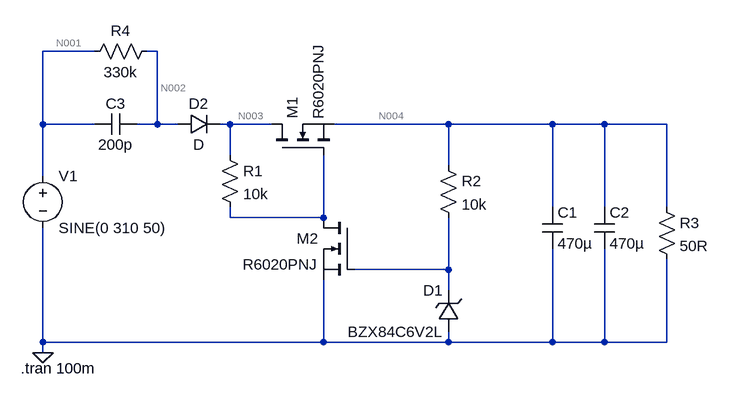
[diagram p0: schematic Draft4.asc]
Draft4.asc, the LTspice schematic file:
Version 4
SHEET 1 1028 680
WIRE 80 -48 0 -48
WIRE 176 -48 160 -48
WIRE 0 64 0 -48
WIRE 80 64 0 64
WIRE 176 64 176 -48
WIRE 176 64 144 64
WIRE 208 64 176 64
WIRE 288 64 272 64
WIRE 352 64 288 64
WIRE 624 64 448 64
WIRE 784 64 624 64
WIRE 864 64 784 64
WIRE 960 64 864 64
WIRE 288 112 288 64
WIRE 624 128 624 64
WIRE 0 144 0 64
WIRE 784 192 784 64
WIRE 864 192 864 64
WIRE 960 192 960 64
WIRE 288 208 288 192
WIRE 432 208 432 112
WIRE 432 208 288 208
WIRE 624 288 624 208
WIRE 624 288 480 288
WIRE 624 320 624 288
WIRE 0 400 0 224
WIRE 432 400 432 304
WIRE 432 400 0 400
WIRE 624 400 624 384
WIRE 624 400 432 400
WIRE 784 400 784 256
WIRE 784 400 624 400
WIRE 864 400 864 256
WIRE 864 400 784 400
WIRE 960 400 960 272
WIRE 960 400 864 400
WIRE 0 416 0 400
FLAG 0 416 0
SYMBOL voltage 0 128 R0
WINDOW 123 0 0 Left 2
WINDOW 39 0 0 Left 2
SYMATTR InstName V1
SYMATTR Value SINE(0 310 50)
SYMBOL zener 640 384 R180
WINDOW 0 24 64 Left 2
WINDOW 3 24 0 Left 2
SYMATTR InstName D1
SYMATTR Value BZX84C6V2L
SYMBOL nmos 352 112 R270
SYMATTR InstName M1
SYMATTR Value R6020PNJ
SYMBOL diode 208 80 R270
WINDOW 0 32 32 VTop 2
WINDOW 3 0 32 VBottom 2
SYMATTR InstName D2
SYMBOL res 272 96 R0
SYMATTR InstName R1
SYMATTR Value 10k
SYMBOL nmos 480 208 M0
SYMATTR InstName M2
SYMATTR Value R6020PNJ
SYMBOL res 608 112 R0
SYMATTR InstName R2
SYMATTR Value 10k
SYMBOL res 944 176 R0
SYMATTR InstName R3
SYMATTR Value 50R
SYMBOL cap 768 192 R0
SYMATTR InstName C1
SYMATTR Value 470µ
SYMBOL cap 848 192 R0
SYMATTR InstName C2
SYMATTR Value 470µ
SYMBOL cap 144 48 R90
WINDOW 0 0 32 VBottom 2
WINDOW 3 32 32 VTop 2
SYMATTR InstName C3
SYMATTR Value 200p
SYMBOL res 176 -64 R90
WINDOW 0 0 56 VBottom 2
WINDOW 3 32 56 VTop 2
SYMATTR InstName R4
SYMATTR Value 330k
TEXT -34 440 Left 2 !.tran 100m

The netlist it stands for:
* Draft4.asc
V1 N001 0 SINE(0 310 50)
D1 0 N006 BZX84C6V2L
M1 N003 N005 N004 N004 R6020PNJ
D2 N002 N003 D
R1 N003 N005 10k
M2 N005 N006 0 0 R6020PNJ
R2 N004 N006 10k
R3 N004 0 50R
C1 N004 0 470µ
C2 N004 0 470µ
C3 N002 N001 200p
R4 N002 N001 330k
.model D D
.lib standard.dio
.model NMOS NMOS
.model PMOS PMOS
.lib standard.mos
.tran 100m
.backanno
.end

* Results of the author's LTspice run, read from the files saved beside the schematic
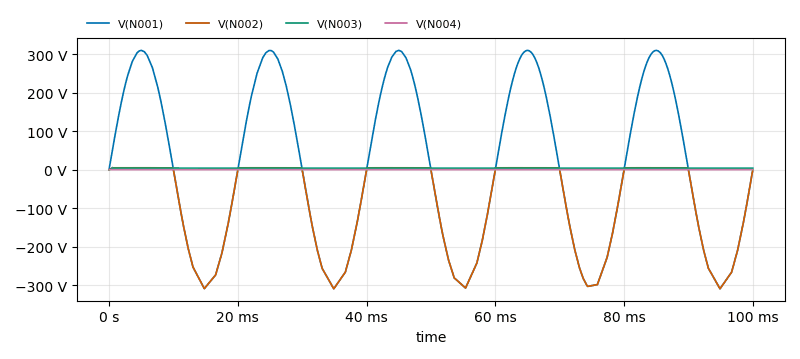
[diagram p1: Transient Analysis of Draft4.asc, plotted from the saved traces]
* Transient Analysis, 1 run:
*   V(N001): min -309.6 V, max 309.9 V, average 1.321 V, rms 217.6 V, last 0 V
*   V(N002): min -309.6 V, max 5.552 V, average -94.78 V, rms 152.9 V, last 0 V
*   V(N003): min 0 V, max 4.945 V, average 3.957 V, rms 3.968 V, last 3.715 V
*   V(N004): min 0 V, max 14.36 mV, average 9.195 mV, rms 9.806 mV, last 11.46 mV